# EAGLE design Grove - Barometer Sensor(BME280) v1.0 (EAGLE 6.4)
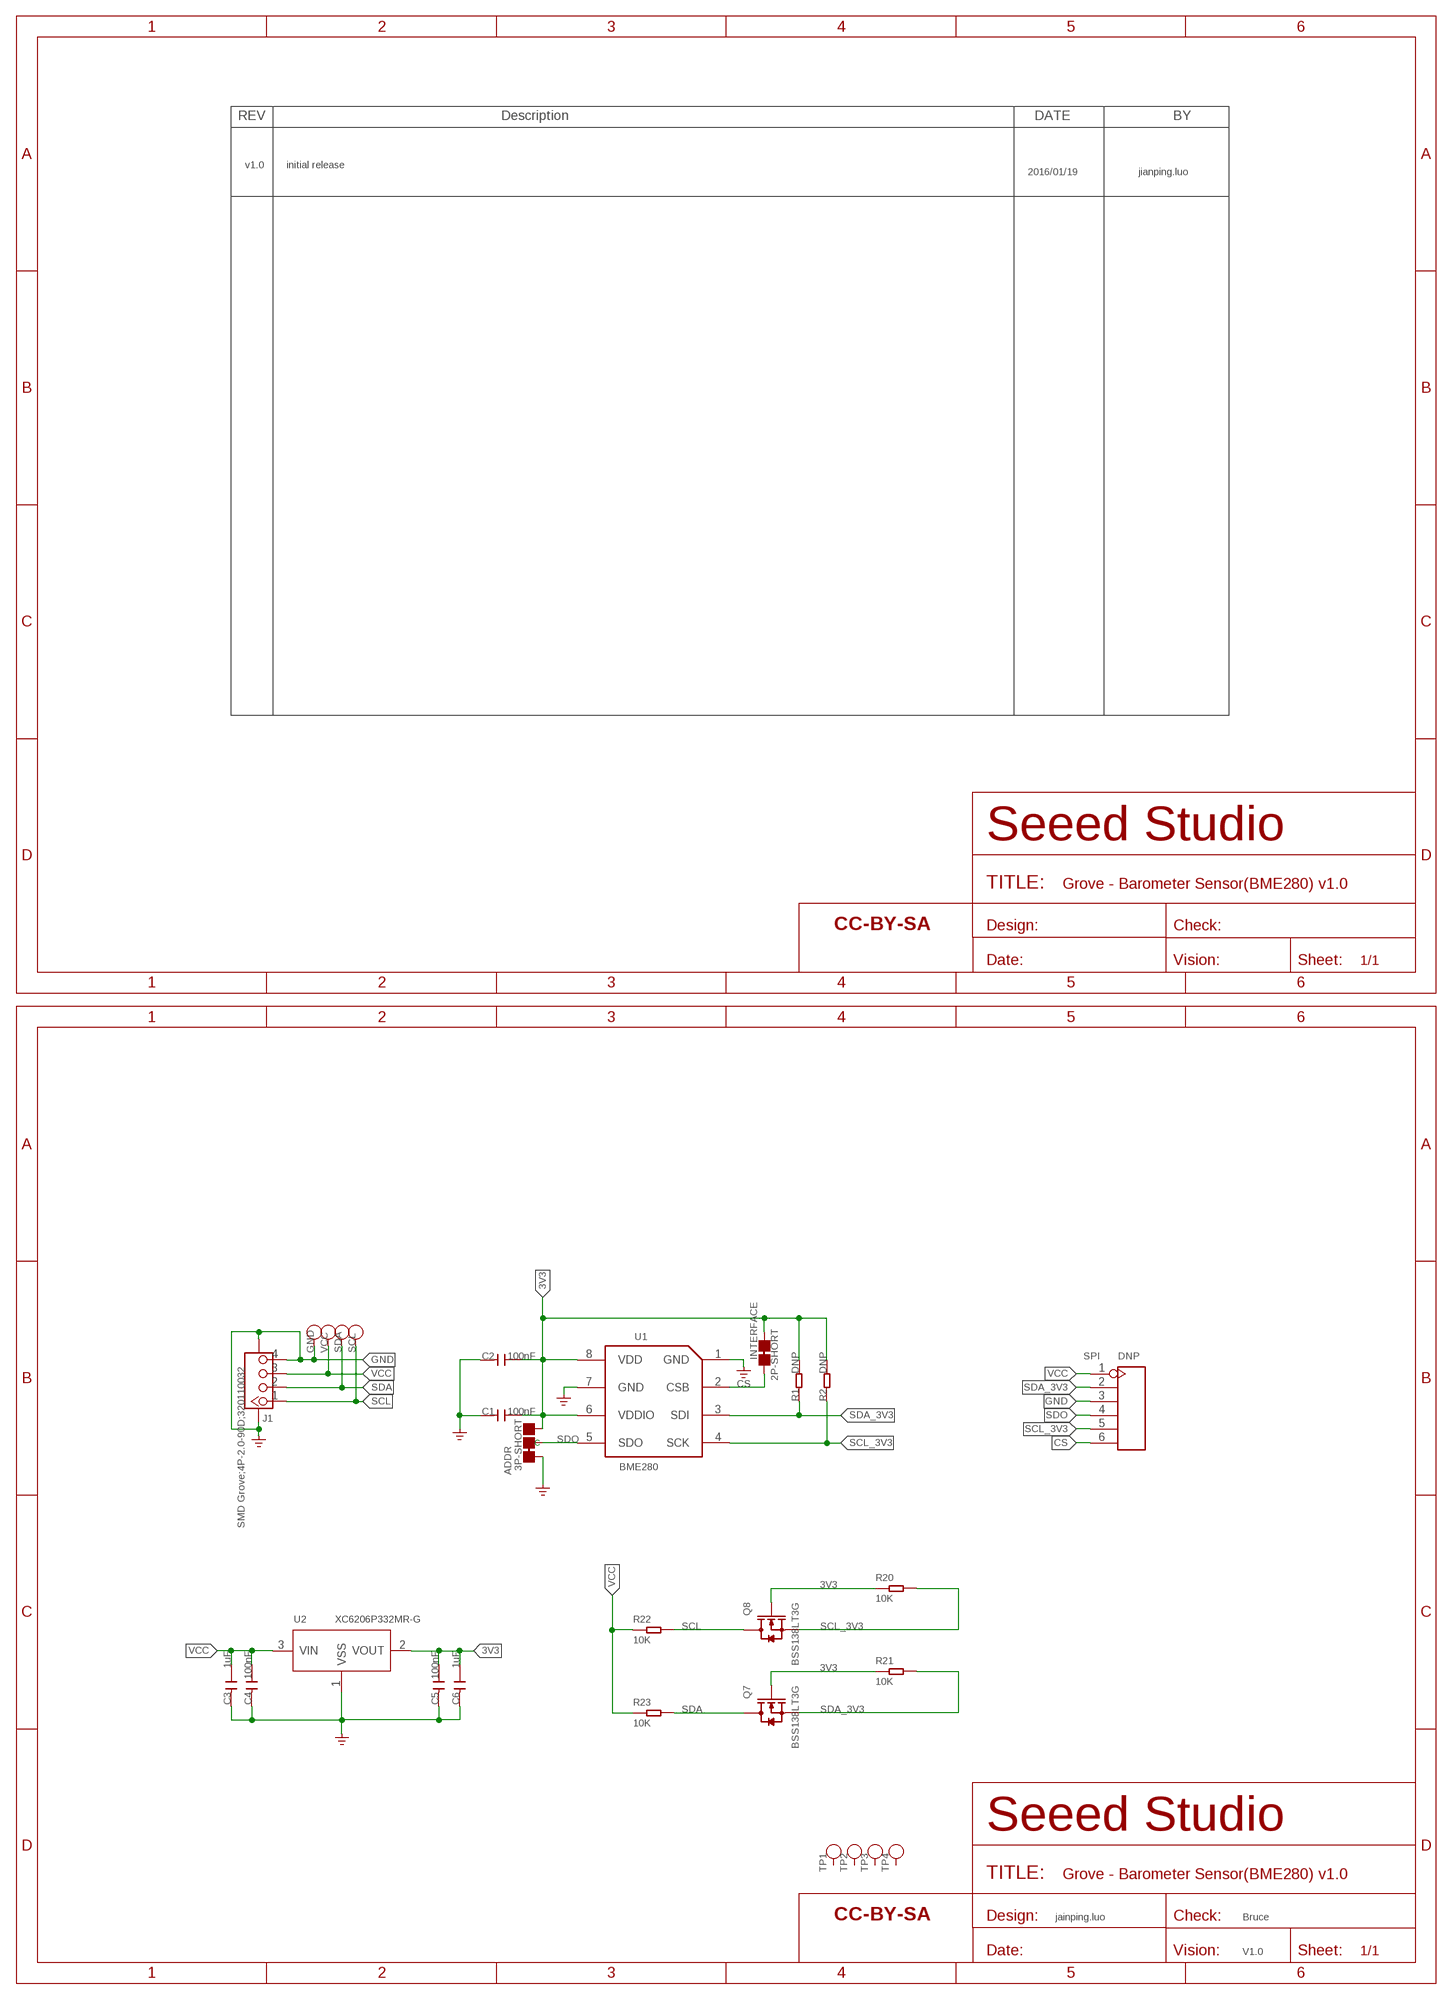
[diagram p0: schematic, sheet 1]

## Parts
ADDR  3P-SHORT  JUMPER-3P-SHORT  [3P-SMD-SHORT]
C1  100nF  CAP-0603  [C0603]
C2  100nF  CAP-0603  [C0603]
C3  1uF  CAP-0603  [C0603]
C4  100nF  CAP-0603  [C0603]
C5  100nF  CAP-0603  [C0603]
C6  1uF  CAP-0603  [C0603]
FR1  SEEEDSTUDIO-OPEN-SCH-FRAME  [SEEEDSTUDIO-PCB-FRAME]
FR2  SEEEDSTUDIO-OPEN-SCH-FRAME  [SEEEDSTUDIO-PCB-FRAME]
GND  TEST-POINT'4545'  [TP-D45MIL]
INTERFACE  2P-SHORT  JUMPER-2P-SHORT  [2P-SMD-SHORT]
J1  SMD Grove;4P-2.0-90D;320110032  GROVE-CONNECTOR-SMD'90D'  [HW4-SMD-2.0-90D]
Q7  BSS138LT3G  MOSFET-N'SOT23'  [SOT-23]
Q8  BSS138LT3G  MOSFET-N'SOT23'  [SOT-23]
R1  DNP  RES-0603  [R0603]
R2  DNP  RES-0603  [R0603]
R20  10K  RES-0603  [R0603]
R21  10K  RES-0603  [R0603]
R22  10K  RES-0603  [R0603]
R23  10K  RES-0603  [R0603]
SCL  TEST-POINT'4545'  [TP-D45MIL]
SDA  TEST-POINT'4545'  [TP-D45MIL]
SPI  DNP  HEADER-6P-65/35MIL  [H6-2.54-C65D35MIL]
TP1  TEST-POINT'4545'  [TP-D45MIL]
TP2  TEST-POINT'4545'  [TP-D45MIL]
TP3  TEST-POINT'4545'  [TP-D45MIL]
TP4  TEST-POINT'4545'  [TP-D45MIL]
U1  BME280  SENSOR-BME280  [LGA8-0.65-2.5X2.5X0.95MM]
U2  XC6206P332MR-G  PMIC-XC6206PMR  [SOT-23]
VCC  TEST-POINT'4545'  [TP-D45MIL]

## Nets
3V3: ADDR.00(R) C1.1 C2.1 C5.1 C6.1 INTERFACE.2 Q7.1(G) Q8.1(G) R1.2 R2.2 R20.1 R21.1 U1.6(VDDIO) U1.8(VDD) U2.2(VOUT)
CS: INTERFACE.1 SPI.6 U1.2(CSB)
GND: ADDR.11(L) C1.2 C2.2 C3.2 C4.2 C5.2 C6.2 GND.T J1.4 J1.SS1 J1.SS2 SPI.3 U1.1(GND) U1.7(GND) U2.1(VSS) ; supply symbol labelled GND_POWER
SCL: J1.1 Q8.3(D) R22.2 SCL.T
SCL_3V3: Q8.2(S) R2.1 R20.2 SPI.5 U1.4(SCK)
SDA: J1.2 Q7.3(D) R23.2 SDA.T
SDA_3V3: Q7.2(S) R1.1 R21.2 SPI.2 U1.3(SDI)
SDO: ADDR.MM(C) SPI.4 U1.5(SDO)
VCC: C3.1 C4.1 J1.3 R22.1 R23.1 SPI.1 U2.3(VIN) VCC.T
Unconnected: TP1.T TP2.T TP3.T TP4.T

## Notes on the sheet
- v1.0 | initial release
- 2016/01/19 | jianping.luo
- jainping.luo | Bruce
- V1.0

## Library data of the parts
ADDR = Discrete-new:JUMPER-3P-SHORT
C1-C6 = Discrete-new:CAP: Ceramic Capacitors
FR1 FR2 = moudle-new:SEEEDSTUDIO-OPEN-SCH-FRAME
GND SCL SDA TP1-TP4 VCC = Discrete-new:TEST-POINT; PARTNO: DNP
INTERFACE = Discrete-new:JUMPER-2P-SHORT
J1 = Connector-new:GROVE-CONNECTOR-SMD: 4P-SMD-2.0:320110030;4P-SMD-2.0-90D:320110032
Q7 Q8 = Discrete-new:MOSFET-N
R1 R2 R20-R23 = Discrete-new:RES
SPI = Connector-new:HEADER-6P
U1 = template:SENSOR-BME280: Combined humidity and pressure sensor; MPN: BST-BME280; VALUE: BST-BME280
U2 = IC-new:PMIC-XC6206P: LOW ESR Cap.Compatible Positive Voltage Regulators

## Board
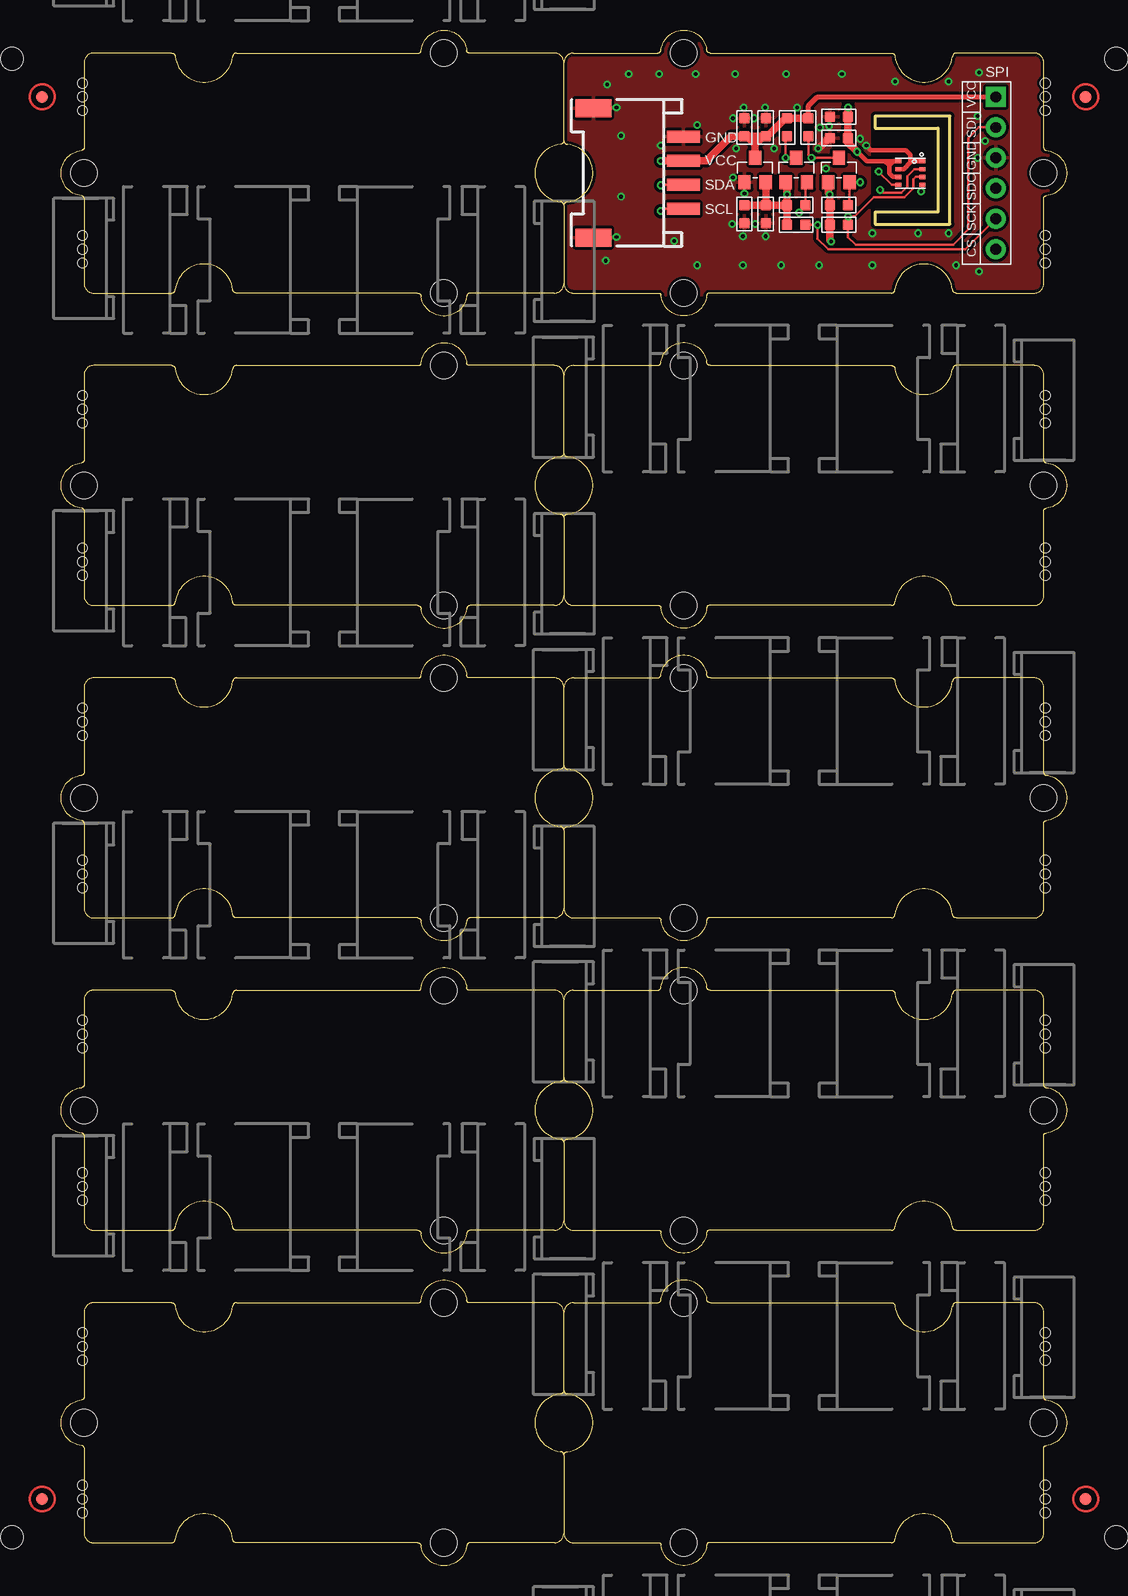
[diagram p1: board, top side]
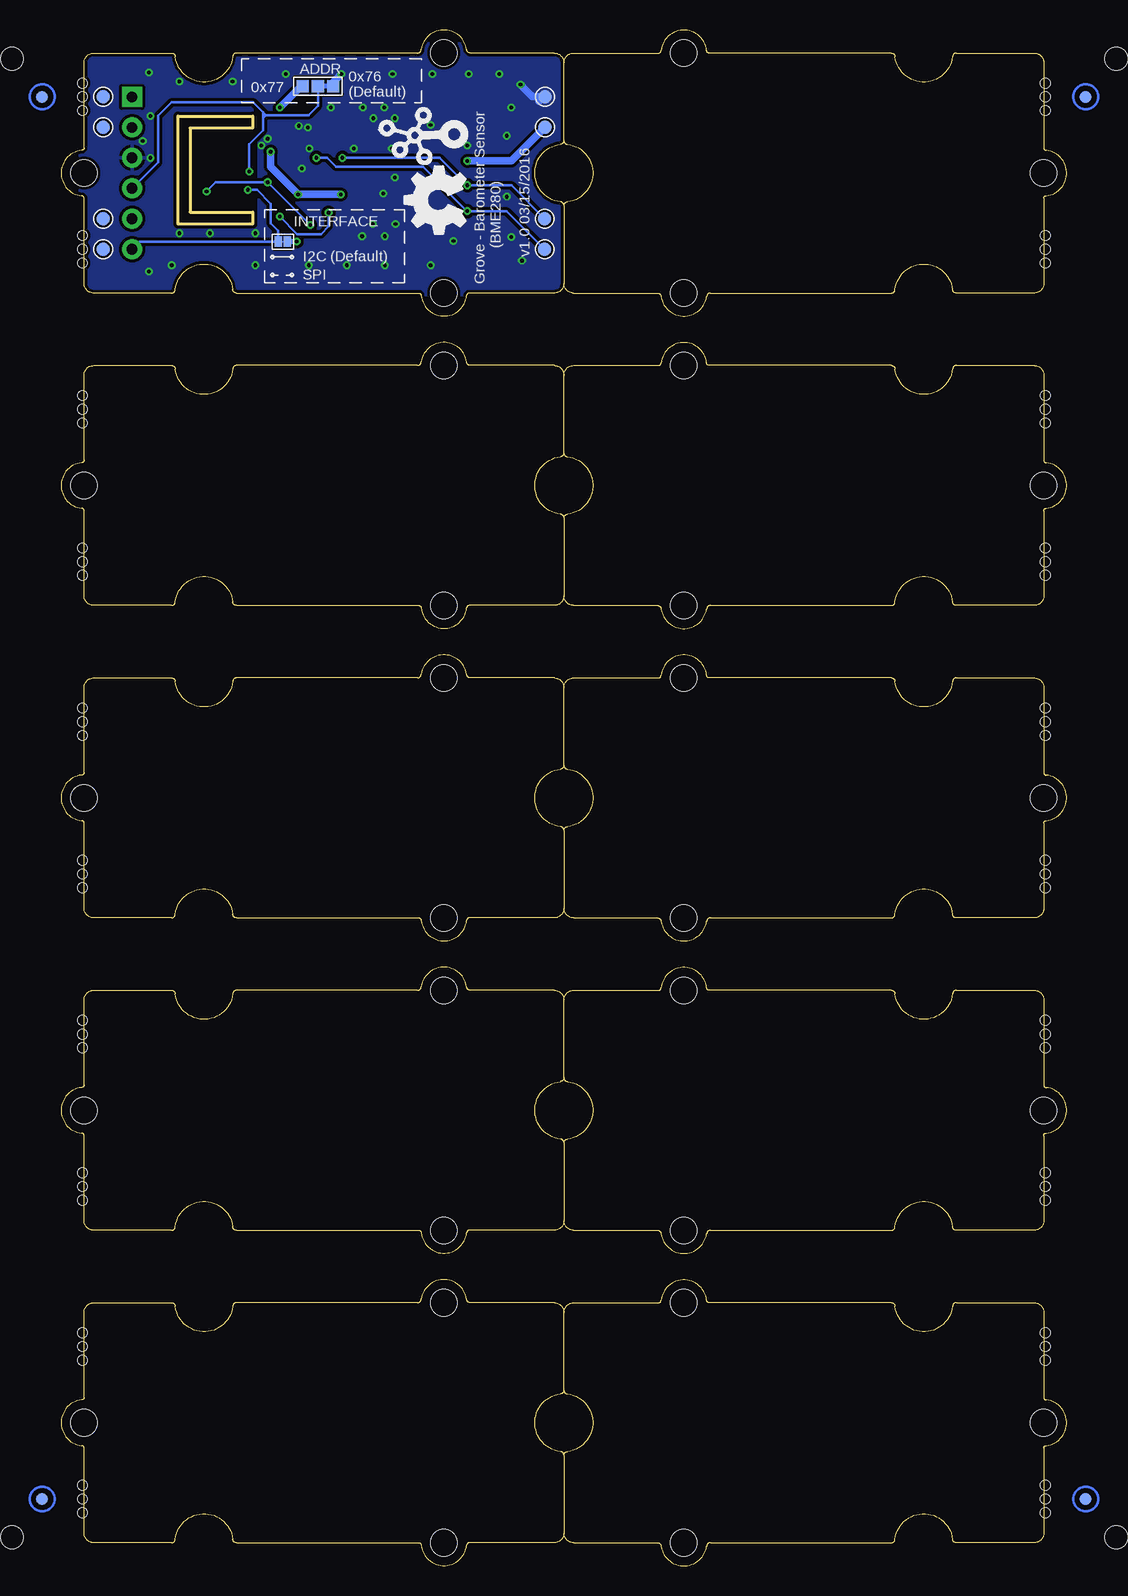
[diagram p2: board, bottom side, seen from below]

Size 83.82 x 127.98 mm. Coordinates in mm from the lower left corner, seen from the top.
Outline: 67.85,119.82 73.09,119.82 73.09,112.82 67.85,112.82 67.85,111.82 74.09,111.82 74.09,120.82 67.85,120.82 67.85,119.82
Copper layers (1*16): Top 0.035mm / dielectric 1.5mm / Bottom 0.035mm
Design rules "SeeedStudio_2layer_DRU_no_angle_20140221 *": minimum track width 6mil, minimum drill 12mil, track to track 6mil, track to pad 6mil, pad to pad 6mil, via to via 6mil, smd to smd 0mil, copper to edge 10mil, drill to drill 10mil, minimum pad ring 10mil, minimum via ring 6mil, stop-mask expansion 2mil, vias tented up to drill 25mil, thermal gap 10mil
Holes 0.8 mm at 1.78,123.55 1.78,121.27 1.78,122.41 1.78,110.85 1.78,108.57 1.78,109.71 1.78,97.52 1.78,95.23 1.78,96.38 1.78,84.82 1.78,82.53 1.78,83.68 1.78,71.48 1.78,69.2 1.78,70.34 1.78,58.78 1.78,56.5 1.78,57.64 1.78,45.45 1.78,43.16 1.78,44.31 1.78,32.75 1.78,30.46 1.78,31.61 1.78,19.41 1.78,17.13 1.78,18.27 1.78,6.71 1.78,4.43 1.78,5.57 82.04,121.27 82.04,123.55 82.04,122.41 82.04,108.57 82.04,110.85 82.04,109.71 82.04,95.23 82.04,97.52 82.04,96.38 82.04,82.53 82.04,84.82 82.04,83.68 82.04,69.2 82.04,71.48 82.04,70.34 82.04,56.5 82.04,58.78 82.04,57.64 82.04,43.16 82.04,45.45 82.04,44.31 82.04,30.46 82.04,32.75 82.04,31.61 82.04,17.13 82.04,19.41 82.04,18.27 82.04,4.43 82.04,6.71 82.04,5.57
Holes 1.91 mm at -4.13,2.4 87.95,2.4 87.95,125.59 -4.13,125.59
tRestrict: area 67.8,111.7 to 74.1,120.9
bRestrict: area 67.8,111.7 to 74.1,120.9

### Footprints (pad centres in the part's own frame; a part is rotated, then mirrored left to right if it is on the bottom)
3P-SMD-SHORT = smd 1.016 x 1.016: 00 -1.27,0; 11 1.27,0; MM 0,0
C0603 = smd 0.889 x 0.889: 1 0,0.762; 2 0,-0.762
TP-D45MIL = smd 1.143 x 1.143: T 0,0
2P-SMD-SHORT = smd 0.889 x 0.61: 1 0,0.381; 2 0,-0.381
HW4-SMD-2.0-90D = smd 1.01 x 2.74: 1 -3,-0.1; 2 -1,-0.1; 3 1,-0.1; 4 3,-0.1 | smd 1.5 x 3: SS1 -5.4,7.4; SS2 5.4,7.4
ROUND-MARK-1.0 = smd 1.016 x 1.016: P$1 0,0
SOT-23 = smd 1.016 x 1.143: 1 -0.889,-1.016; 2 0.889,-1.016; 3 0,1.016
R0603 = smd 0.889 x 0.889: 1 0,0.762; 2 0,-0.762
H6-2.54-C65D35MIL = drill 0.889 pad 1.651 square: 1 0,6.35 | drill 0.889 pad 1.651: 2 0,3.81; 3 0,1.27; 4 0,-1.27; 5 0,-3.81; 6 0,-6.35
LGA8-0.65-2.5X2.5X0.95MM = smd 0.5 x 0.35: 1 1,0.975; 2 1,0.325; 3 1,-0.325; 4 1,-0.975; 5 -1,-0.975; 6 -1,-0.325; 7 -1,0.325; 8 -1,0.975
GROVE-TEST-PLATFORM = hole 2.2: -10,-10; -10,10; 20,0

### Placement (x,y rotation side)
ADDR  62.42,123.3 0 bottom
C1  64.83,118.98 270 top
C2  64.83,120.76 270 top
C3  56.96,119.87 180 top
C4  58.74,119.87 180 top
C5  56.96,112.63 0 top
C6  58.74,112.63 0 top
FR1  6.54,-16.78 0 top  (outside the outline)
FR2  5.78,-27.19 0 top  (outside the outline)
GND  43.5,122.41 90 bottom
INTERFACE  65.34,110.35 90 bottom
J1  51.76,116.07 90 top
P1  [ROUND-MARK-1.0]  -1.59,5.57 0 top
P2  [ROUND-MARK-1.0]  85.41,5.57 0 top
P3  [ROUND-MARK-1.0]  -1.59,122.41 0 top
P4  [ROUND-MARK-1.0]  85.41,122.41 0 top
P5  [ROUND-MARK-1.0]  -1.59,5.57 0 bottom
P6  [ROUND-MARK-1.0]  85.41,5.57 0 bottom
P7  [ROUND-MARK-1.0]  85.41,122.41 0 bottom
P8  [ROUND-MARK-1.0]  -1.59,122.41 0 bottom
Q7  61.28,116.32 0 top
Q8  64.83,116.32 0 top
R1  64.83,111.74 270 top
R2  61.28,111.74 270 top
R20  64.83,113.39 90 top
R21  61.28,113.39 90 top
R22  62.29,119.87 0 top
R23  60.52,119.87 0 top
SCL  43.51,109.72 90 bottom
SDA  43.51,112.26 90 bottom
SPI  77.92,116.06 0 top
TP1  80.33,122.41 0 bottom
TP2  80.33,119.87 0 bottom
TP3  80.33,112.25 0 bottom
TP4  80.33,109.71 0 bottom
U1  70.8,116.06 0 top
U2  57.85,116.32 0 top
U3  [GROVE-TEST-PLATFORM]  61.91,37.96 0 top
U4  [GROVE-TEST-PLATFORM]  21.91,37.96 180 top
U5  [GROVE-TEST-PLATFORM]  61.91,63.99 0 top
U6  [GROVE-TEST-PLATFORM]  21.91,63.99 180 top
U7  [GROVE-TEST-PLATFORM]  61.91,90.03 0 top
U8  [GROVE-TEST-PLATFORM]  21.91,90.03 180 top
U9  [GROVE-TEST-PLATFORM]  21.91,116.06 180 top
U10  [GROVE-TEST-PLATFORM]  61.91,116.06 0 top
U11  [GROVE-TEST-PLATFORM]  61.91,11.92 0 top
U12  [GROVE-TEST-PLATFORM]  21.91,11.92 180 top
U$3  [OSHW_FILLX200_NOTEXT]  50.1,110.98 90 bottom
U$4  [TWIGLOGO]  50.86,119.24 90 bottom
VCC  43.5,119.87 90 bottom

### Tracks (layer width: path | path; a pad name or v marks a point on that pad's centre or on a via)
3V3  (via drill 0.3 pad 0.64)
  Top 0.356: U1.8 69.37,117.04 | 69.37,117.04 69.03,117.04 | 69.03,117.04 68.69,117.04 | 68.69,117.04 67.16,117.04 v66.36,117.84 | U1.6 69.35,115.74 69.03,116.06 69.03,116.7 | 69.03,116.7 69.03,117.04 | 68.69,117.04 69.03,116.7 | 69.37,117.04 69.03,116.7
  Top 0.61: C6.1 U2.2 | C6.1 C5.1 | C6.1 R21.1 | R21.1 v60.52,114.28 60.52,115.17 Q7.1 | R21.1 R2.2 | Q8.1 63.95,114.41 v64.07,114.28 R20.1 R1.2 64.07,110.47 v64.2,110.35 | v66.36,117.84 65.6,118.6 C1.1 C2.1 v65.6,121.52
  Bottom 0.406: v64.2,110.35 INTERFACE.2
  Bottom 0.61: v60.52,114.28 v64.07,114.28 66.36,116.57 v66.36,117.84 | ADDR.00 63.82,123.3 v65.6,121.52
CS  (via drill 0.3 pad 0.64)
  Top 0.203: U1.2 71.13,116.39 70.55,115.81 70.55,114.92 70.04,114.41 68.52,114.41 v68.26,114.66
  Bottom 0.203: SPI.6 77.28,110.35 INTERFACE.1 65.72,111.24 66.36,111.87 66.36,113.52 67.5,114.66 v68.26,114.66
GND  (via drill 0.3 pad 0.64)
  Top 0.356: U1.7 70.24,116.39 70.8,116.95 | 70.8,116.95 70.89,117.04 U1.1 | 70.8,116.95 70.8,117.59 70.42,117.97 67.5,117.97 v67.12,118.35
  Top 0.61: C1.2 64.01,118.98 v63.12,118.09
  Bottom 0.61: v45.53,123.43 44.51,122.41 GND.T 43.63,122.41 44.01,122.03 | ADDR.11 61.15,123.62 v60.45,124.32
  other vias: 66.61,118.92 46.29,121.52 46.29,110.73 49.98,118.35 53.02,120.06 45.4,108.76 46.67,114.09 46.67,119.17 51.12,110.41 53.02,108.38 56.83,108.38 56.83,110.79 58.74,110.79 60.01,108.38 63.18,108.38 67.63,108.38 74.61,108.38 76.52,107.87 56.01,120.63 56.9,121.52 58.67,121.52 57.79,120.63 56.2,124.32 52.9,124.32 49.85,124.32 47.31,124.32 65.09,124.32 69.53,123.68 73.98,123.68 76.52,124.44 77.03,118.73 76.39,120.82 76.39,117.33 57.85,111.81 55.94,111.81 56.96,114.35 56.01,115.68 56.26,118.09 59.44,118.09 64.01,120 63.25,119.87 61.34,121.52 67.63,111.04 71.44,111.04 73.98,111.04 63.75,116.44
  pour Top (isolate 0.254): 41.59,126.86 82.23,126.86 82.23,105.9 41.59,105.9
  pour Bottom (isolate 0.254): 41.59,126.86 82.23,126.86 82.23,105.9 41.59,105.9
SCL  (via drill 0.3 pad 0.64)
  Top 0.203: J1.1 50.16,113.07 v49.98,112.89 | R22.2 62.29,117.59 v62.55,117.33 Q8.3
  Bottom 0.203: SCL.T 46.68,112.89 v49.98,112.89 53.66,116.57 60.9,116.57 61.66,117.33 v62.55,117.33
SCL_3V3  (via drill 0.3 pad 0.64)
  Top 0.203: 71.73,115.09 U1.4 71.8,114.65 v71.69,114.54 | SPI.5 75.38,109.71 63.95,109.71 63.06,110.6 v63.06,111.74 R2.1 | R20.2 65.72,113.52 Q8.2 v66.61,115.3
  Bottom 0.203: v63.06,111.74 v66.61,115.3 70.93,115.3 v71.69,114.54
SDA  (via drill 0.3 pad 0.64)
  Top 0.203: J1.2 50,115.07 v49.98,115.05 | Q7.3 v60.39,117.33 60.39,118.98 R23.2
  Bottom 0.203: SDA.T 46.3,115.05 v49.98,115.05 52.26,117.33 v60.39,117.33
SDA_3V3  (via drill 0.3 pad 0.64)
  Top 0.203: Q7.2 62.04,115.17 R21.2 62.04,113.27 v61.53,112.76 | 65.47,111.87 R1.1 | R1.1 v65.6,112.44 66.17,112.44 67.76,114.03 70.3,114.03 71.06,114.79 71.06,115.55 71.24,115.74 U1.3 | R1.1 65.6,110.73 66.23,110.09 74.36,110.09 75.63,111.36 75.63,118.98 76.52,119.87 SPI.2
  Bottom 0.203: v61.53,112.76 61.53,111.62 62.17,110.98 64.14,110.98 v65.6,112.44
SDO  (via drill 0.3 pad 0.64)
  Top 0.203: U1.5 69.24,115.09 v68.14,116.19
  Bottom 0.203: 66.99,120.63 66.99,119.62 68.14,118.47 v68.14,116.19 | 66.99,120.63 66.99,120.89 | 66.99,120.89 66.99,121.14 | 66.99,121.14 67.82,121.97 74.61,121.97 75.76,120.82 75.76,116.95 SPI.4 | ADDR.MM 62.42,121.65 63.18,120.89 66.74,120.89 | 66.74,120.89 66.99,120.89 | 66.74,120.89 66.99,121.14 | 66.74,120.89 66.99,120.63
VCC  (via drill 0.3 pad 0.64)
  Top 0.406: R22.1 62.29,121.65 63.06,122.41 SPI.1
  Top 0.61: v49.98,117.08 v49.98,117.07 J1.3 53.78,117.07 55.82,119.11 C3.1 57.85,119.11 | 57.85,119.11 C4.1 58.87,119.11 60.39,120.63 R23.1 R22.1 | U2.3 57.85,118.47 | 57.85,118.47 57.85,119.11 | 57.85,118.47 57.34,118.98 | 57.85,118.47 58.36,118.98
  Bottom 0.61: VCC.T 46.29,117.08 v49.98,117.08

### Text on the board
tPlace: VCC | GND | SDI | VCC | GND | SDA | SDO | SCL | SCK | CS
bPlace: 0x76 | 0x77 | (Default) | v1.0 03/15/2016 | (Default) | I2C | Grove - Barometer Sensor / (BME280) | SPI